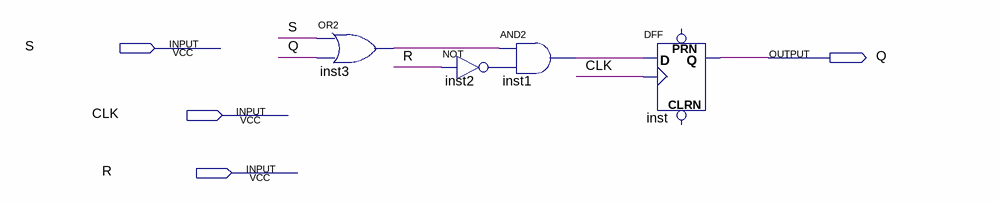
[diagram p0: schematic sheet]
// Quartus schematic MySRFF.bdf as structural Verilog: 4 symbols, 4 pins
module MySRFF (
  input  S,
  input  CLK,
  input  R,
  output Q
);

  wire inst1_out, inst2_out, inst3_out;

  or inst3 (inst3_out, S, Q);
  not inst2 (inst2_out, R);
  and inst1 (inst1_out, inst3_out, inst2_out);
  DFF inst (.CLK(CLK), .D(inst1_out), .Q(Q));  // open: CLRN, PRN
endmodule
